# EasyEDA Pro project ProProject_ads1299+stm32f407第七版_2024-07-30.epro, schematic 无线脑电信号采集系统V1.0

## Sheets
1 原理图_页1_芯片与pcb基本功能: Create Date: 2024-03-14; Page Name: 原理图_页1_芯片与pcb基本功能; Project Name: ads1299+stm32f407第七版; Schematic Name: 无线脑电信号采集系统V1.0; Update Date: 2024-05-11; Company: 广西嵌入式技术与智能系统重点实验室; Drawed: 王中天; Page Size: A4; Version: V1.0
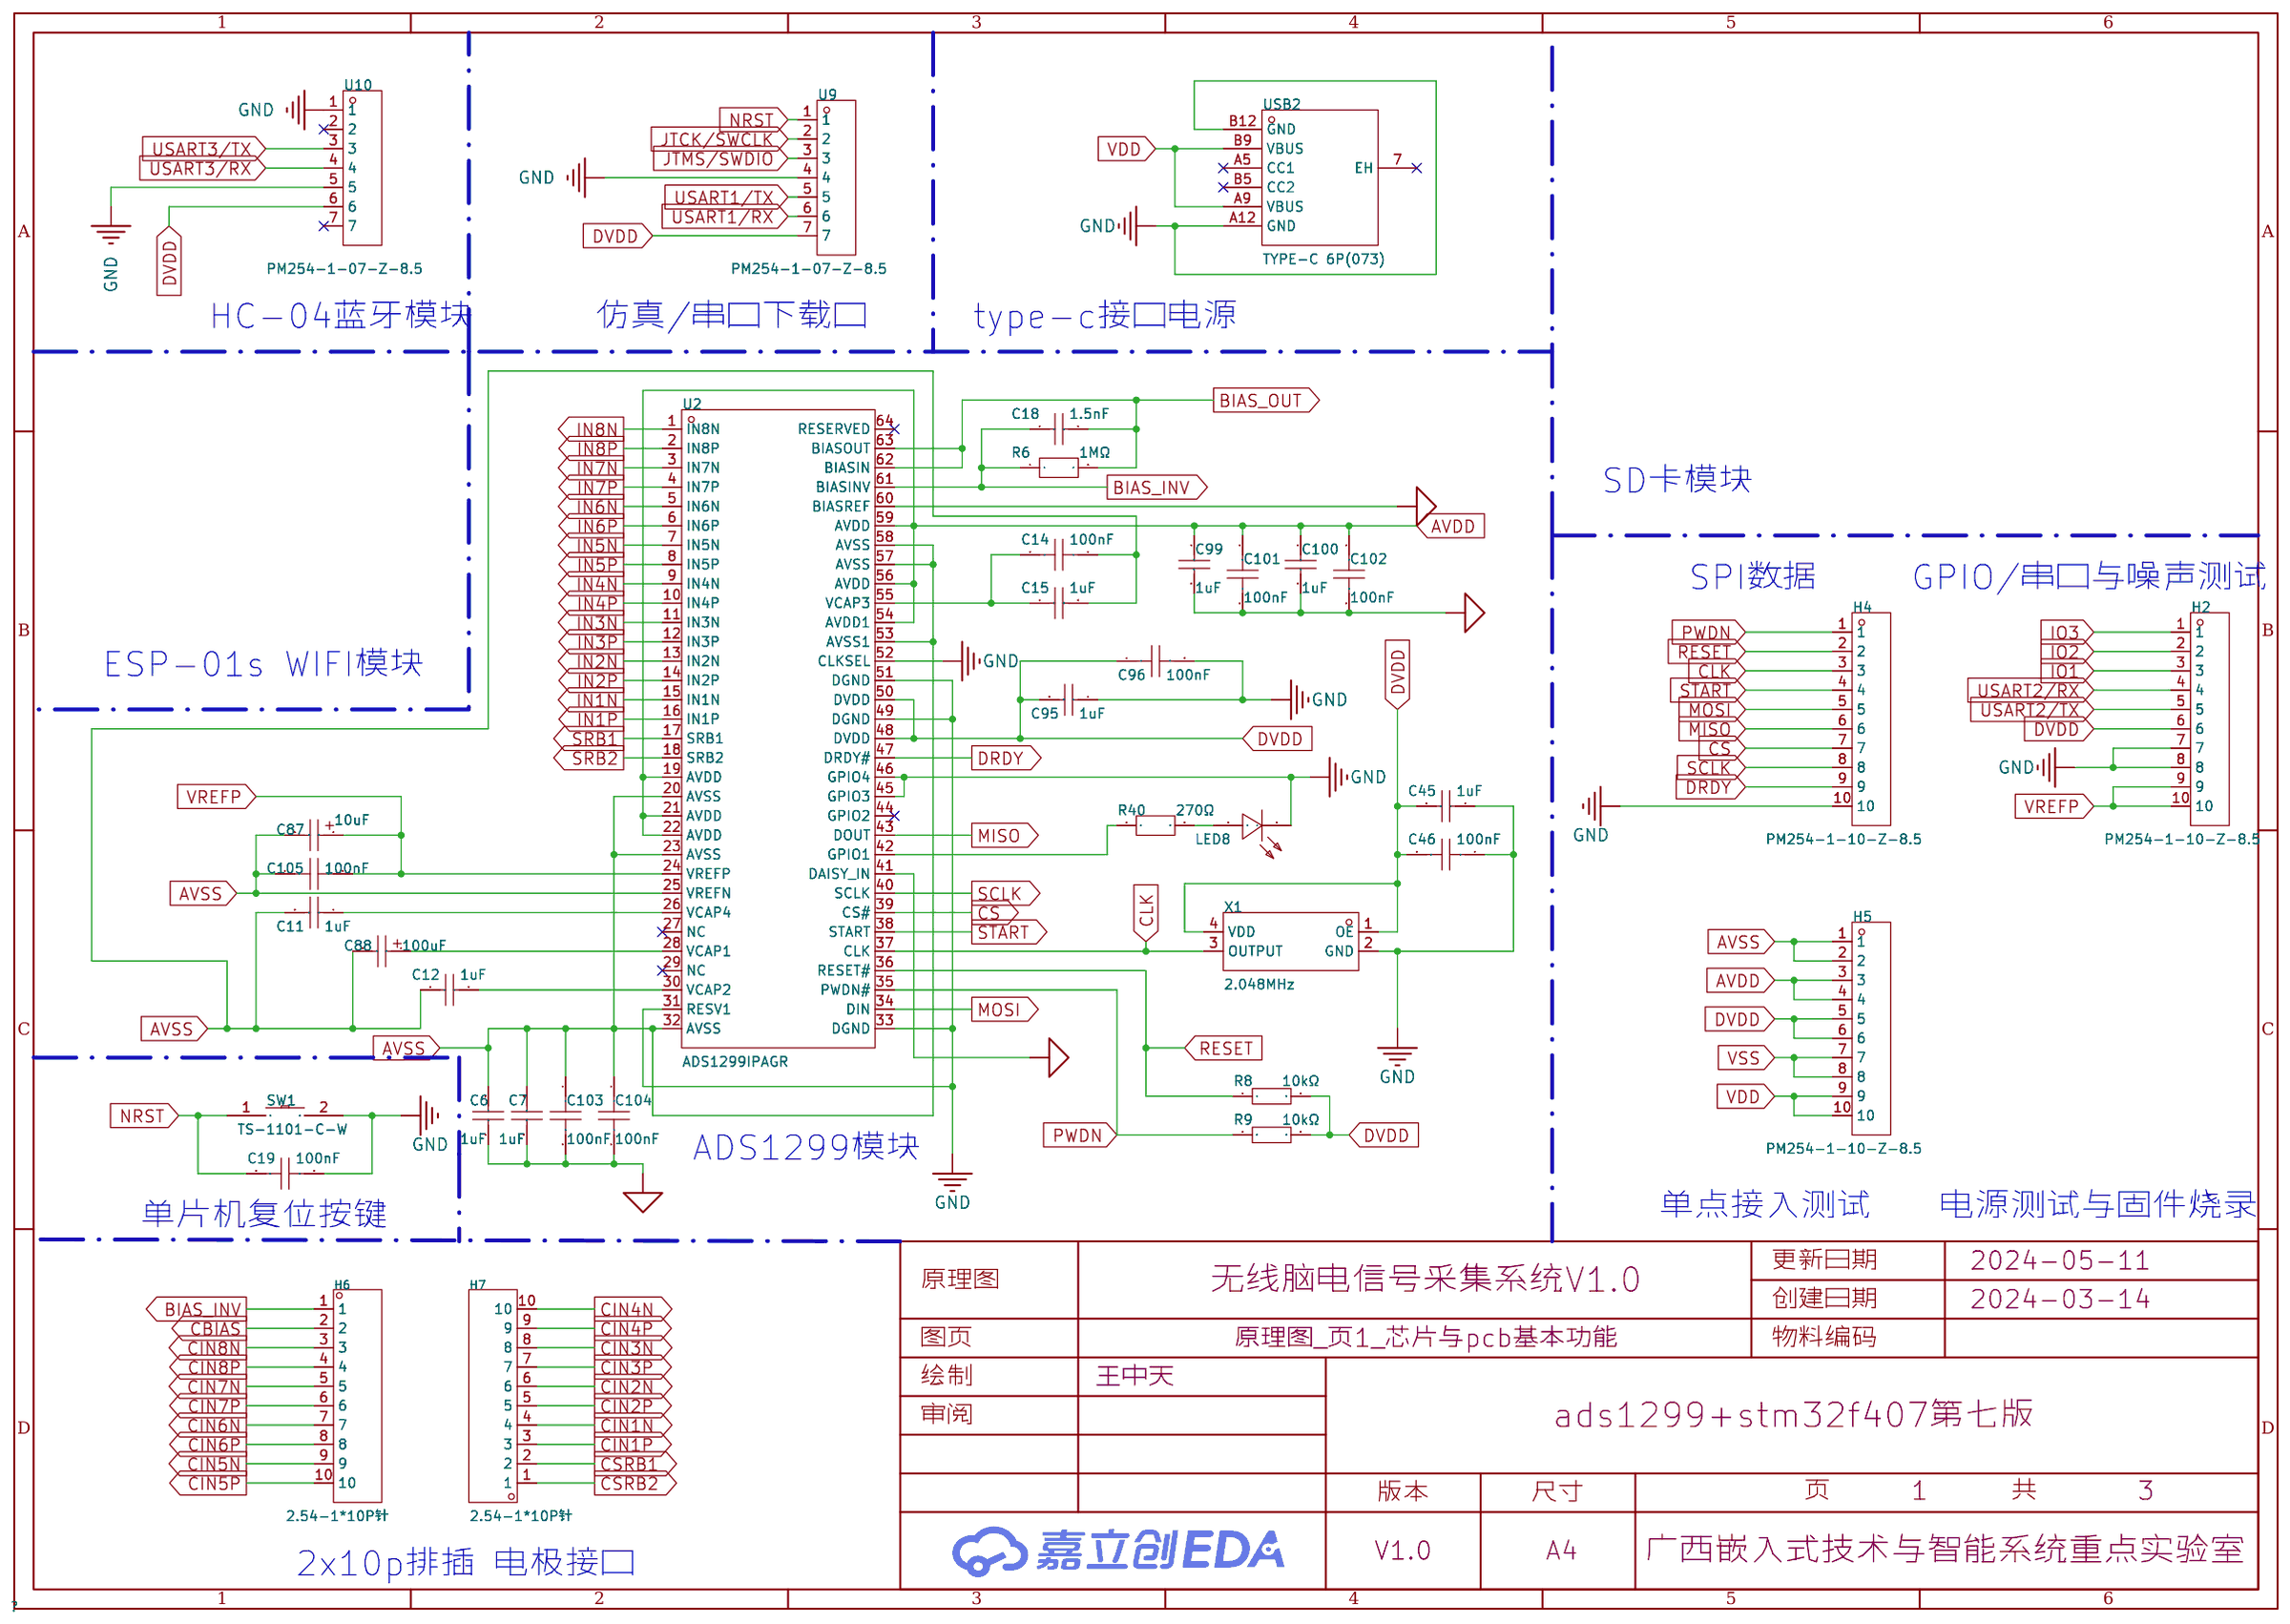
[diagram p0: 原理图_页1_芯片与pcb基本功能]
2 原理图_页2_单片机与电极接入: Create Date: 2024-03-15; Page Name: 原理图_页2_单片机与电极接入
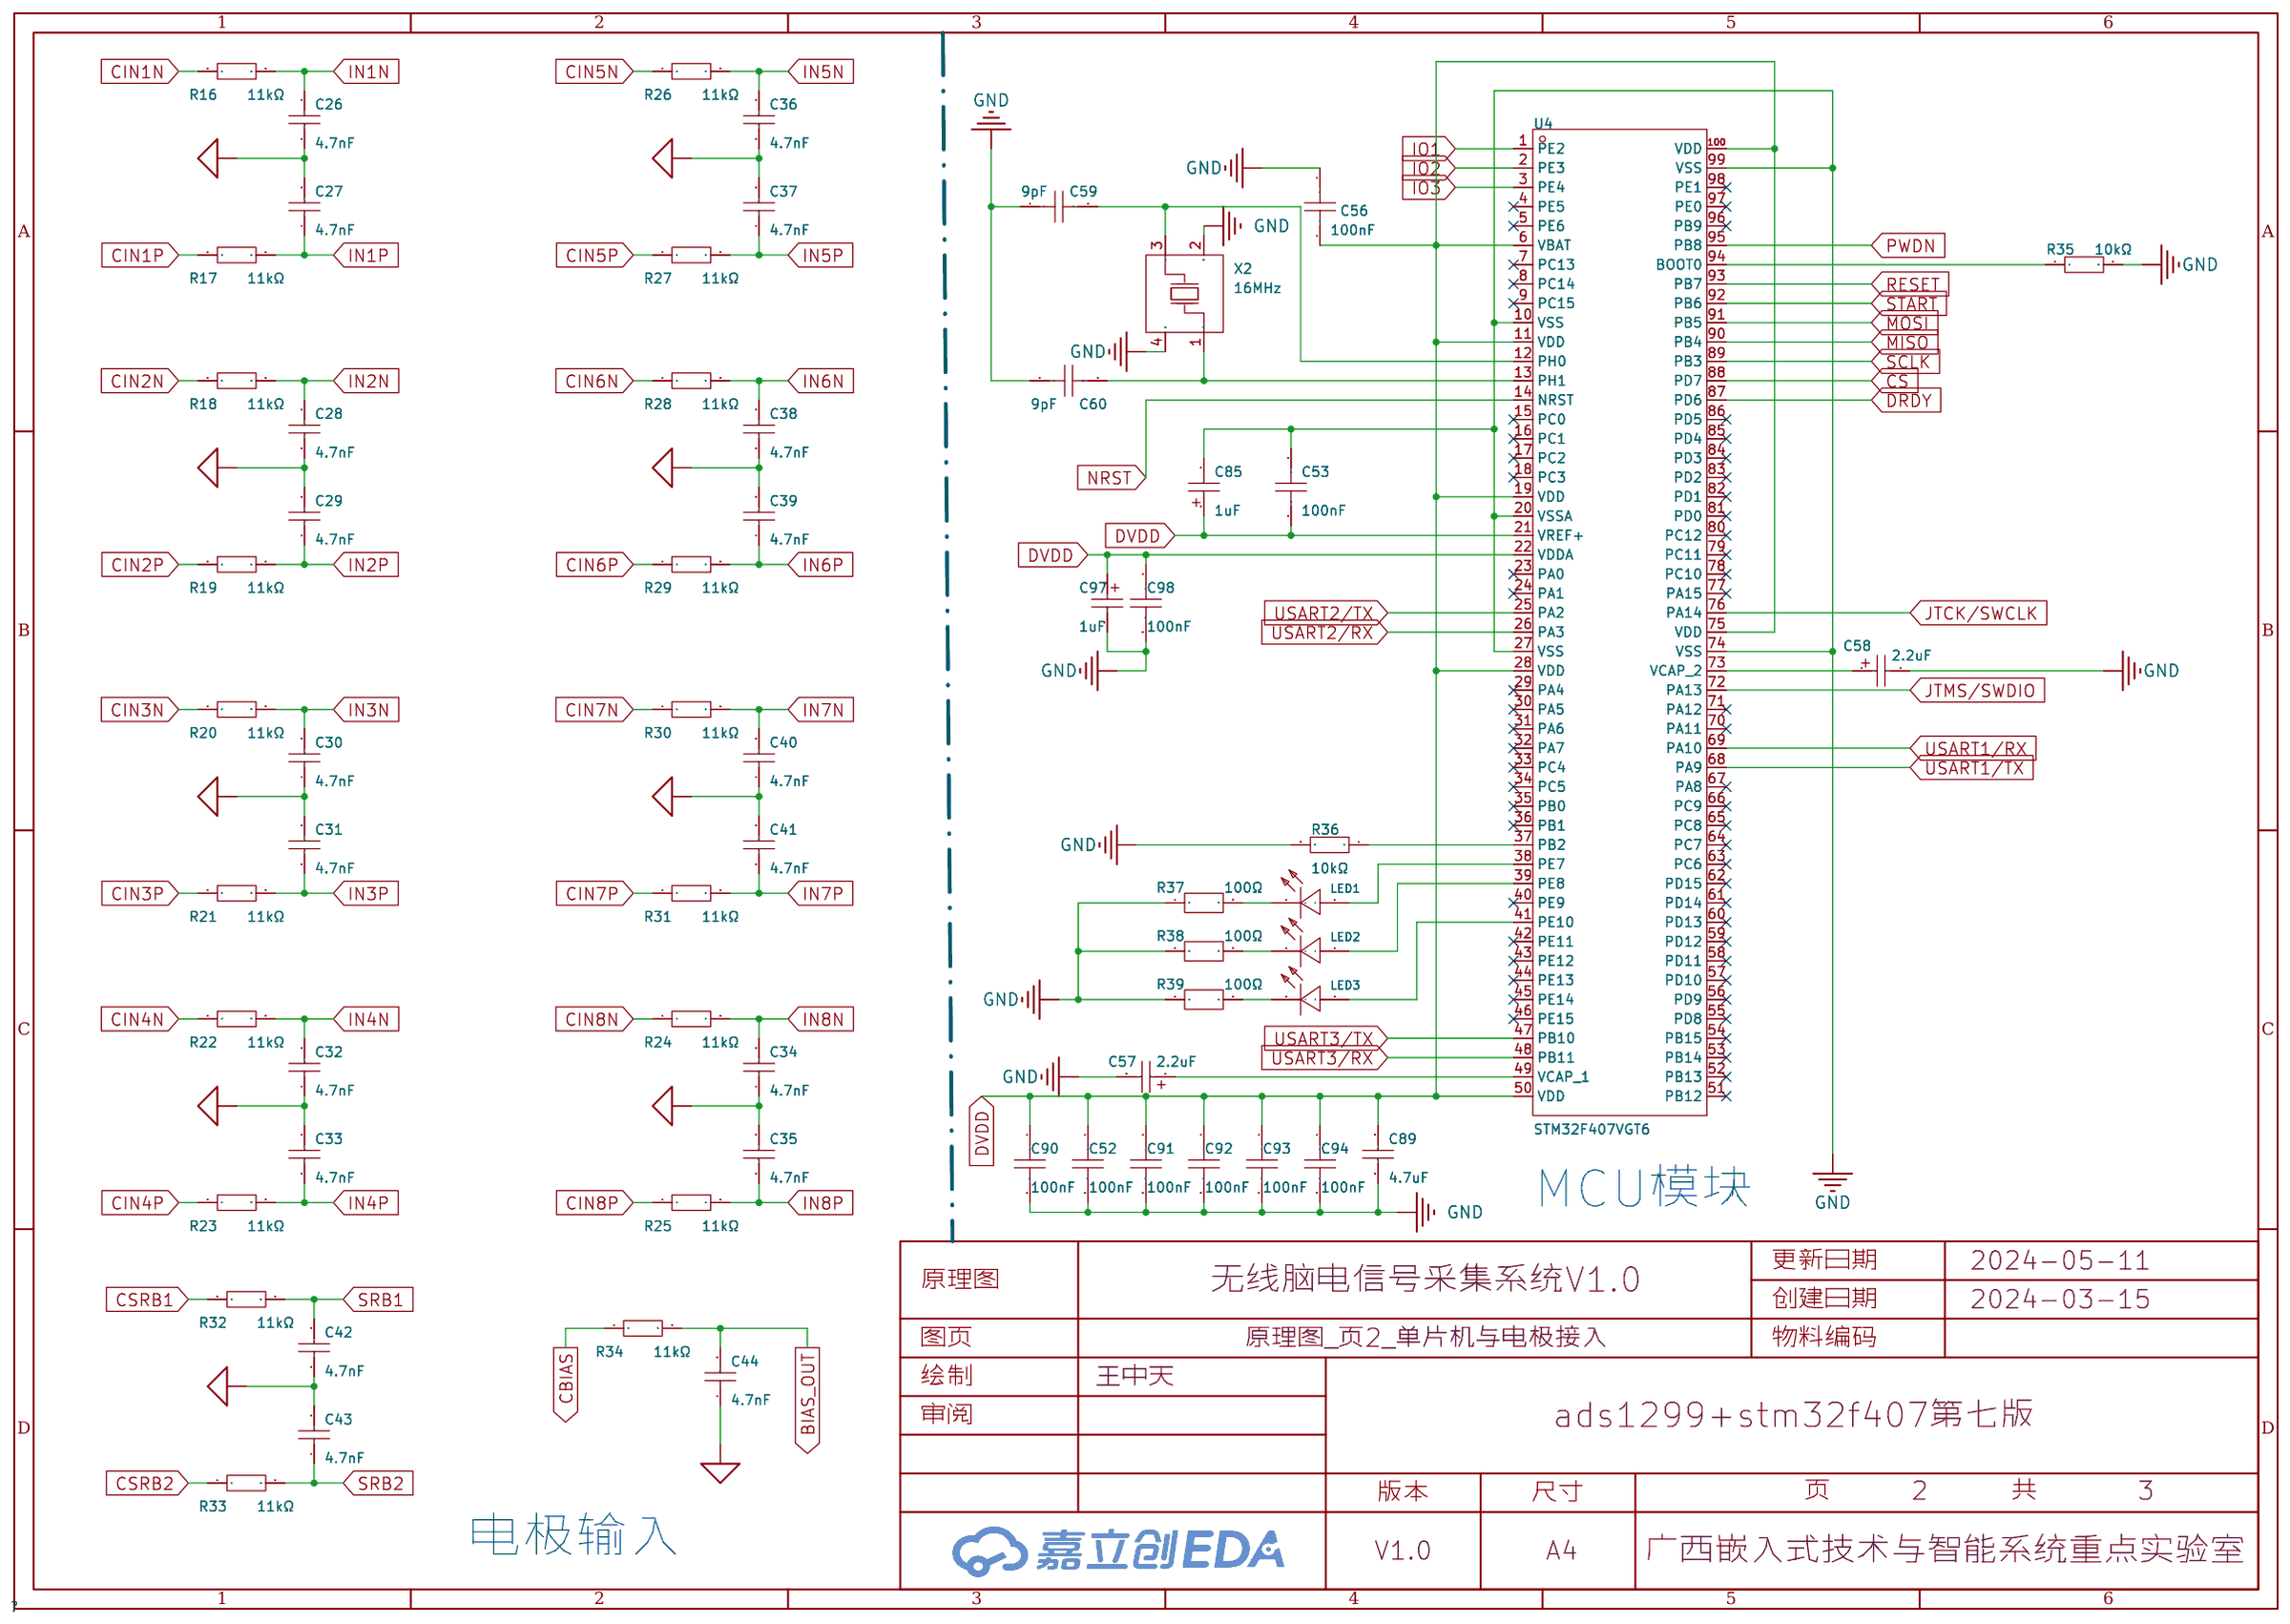
[diagram p1: 原理图_页2_单片机与电极接入]
3 原理图_页3_ldo与扩展功能: Create Date: 2024-03-24; Page Name: 原理图_页3_ldo与扩展功能; Update Date: 2024-05-12
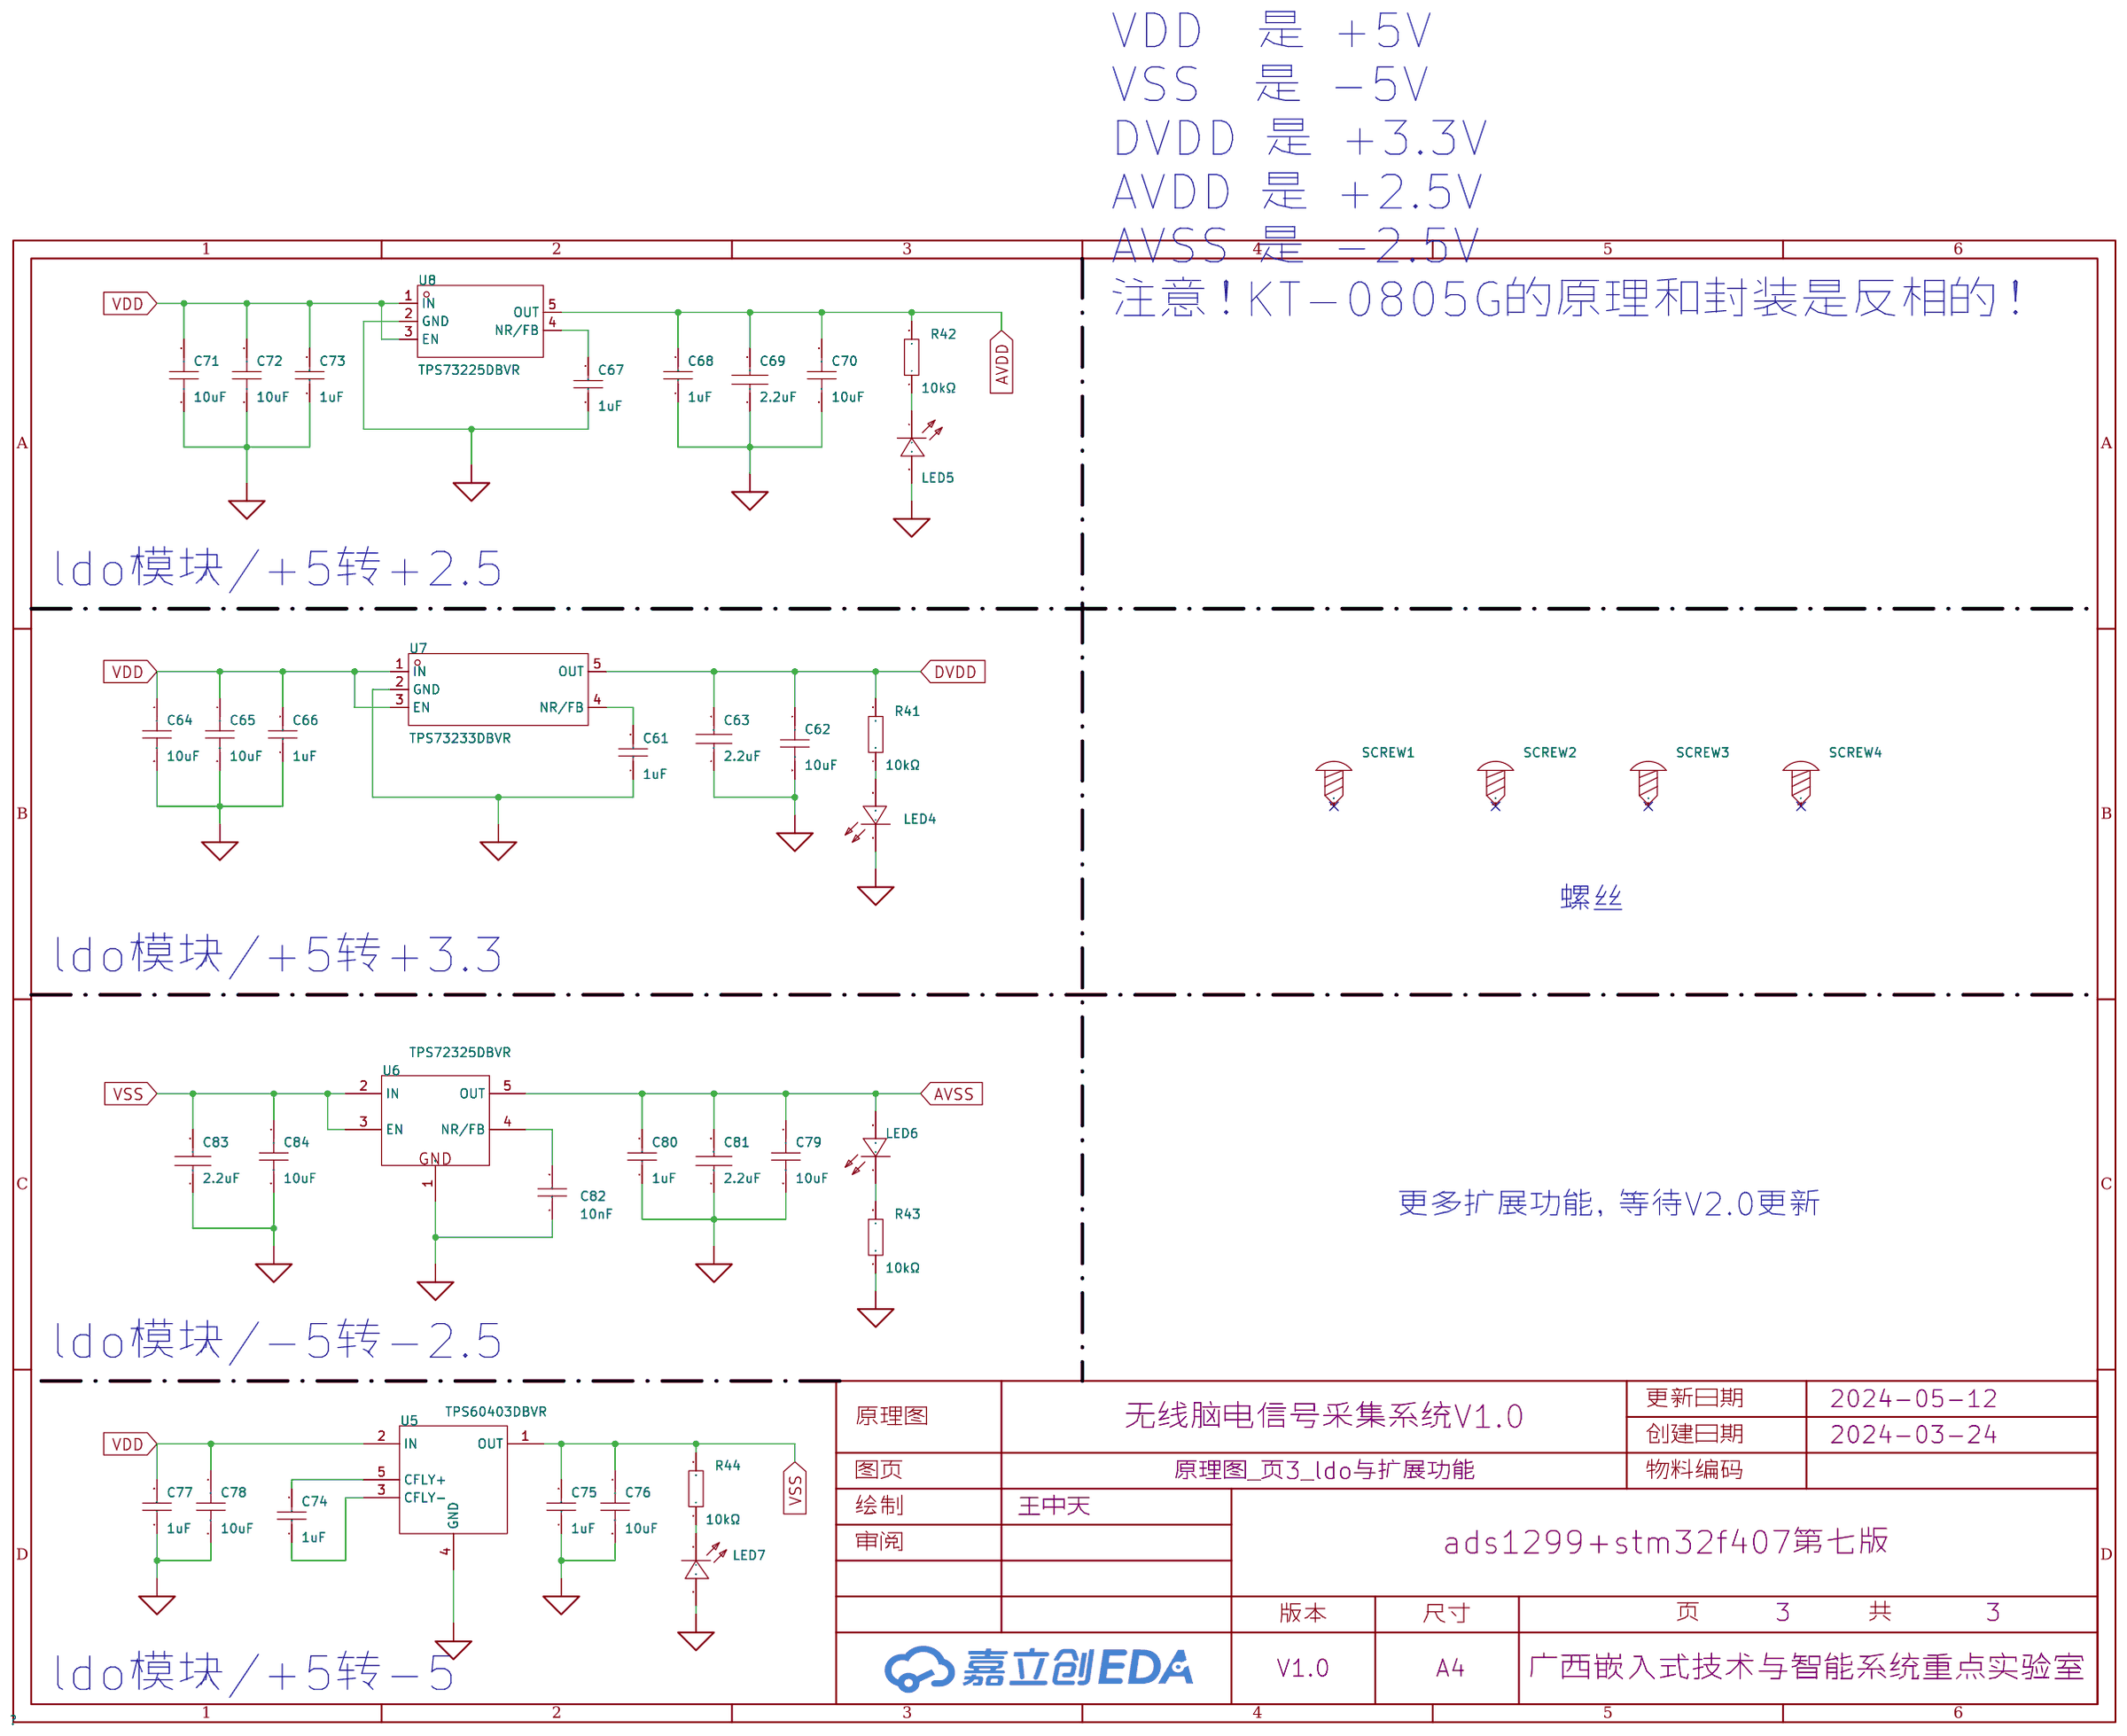
[diagram p2: 原理图_页3_ldo与扩展功能]

## Parts
sheet 原理图_页1_芯片与pcb基本功能
C6  1uF  [C0603]
C7  1uF  [C0603]
C11  1uF  [C0603]
C12  1uF  [C0603]
C14  100nF  [C0603]
C15  1uF  [C0603]
C18  1.5nF  [C0603]
C19  100nF  [C0603]
C45  1uF  [C0603]
C46  100nF  [C0603]
C87  10uF  [C0603]
C88  100uF  [CASE-B_3528]
C95  1uF  [C0603]
C96  100nF  [C0603]
C99  1uF  [C0603]
C100  1uF  [C0603]
C101  100nF  [C0603]
C102  100nF  [C0603]
C103  100nF  [C0603]
C104  100nF  [C0603]
C105  100nF  [C0603]
H2  PM254-1-10-Z-8.5  [HDR-TH_10P-P2.54-V-F]
H4  PM254-1-10-Z-8.5  [HDR-TH_10P-P2.54-V-F]
H5  PM254-1-10-Z-8.5  [HDR-TH_10P-P2.54-V-F]
H6  2.54-1*10P针  [HDR-TH_10P-P2.54-V-M-1]
H7  2.54-1*10P针  [HDR-TH_10P-P2.54-V-M-1]
LED8  KT-0603W  [LED0603-R-RD_WHITE]
R6  1MΩ  [R0805]
R8  10kΩ  [R0603]
R9  10kΩ  [R0603]
R40  270Ω  [R0603]
SW1  TS-1101-C-W  [SW-SMD_L6.0-W3.3-LS8.0]
U2  ADS1299IPAGR  [TQFP-64_L10.0-W10.0-P0.50-LS12.0-TL]
U9  PM254-1-07-Z-8.5  [HDR-TH_7P-P2.54-V-F]
U10  PM254-1-07-Z-8.5  [HDR-TH_7P-P2.54-V-F]
USB2  TYPE-C 6P(073)  [TYPE-C-SMD_TYPE-C-6P]
X1  2.048MHz  [OSC-SMD_4P-L7.0-W5.0-BL]
sheet 原理图_页2_单片机与电极接入
C26  4.7nF  [C0603]
C27  4.7nF  [C0603]
C28  4.7nF  [C0603]
C29  4.7nF  [C0603]
C30  4.7nF  [C0603]
C31  4.7nF  [C0603]
C32  4.7nF  [C0603]
C33  4.7nF  [C0603]
C34  4.7nF  [C0603]
C35  4.7nF  [C0603]
C36  4.7nF  [C0603]
C37  4.7nF  [C0603]
C38  4.7nF  [C0603]
C39  4.7nF  [C0603]
C40  4.7nF  [C0603]
C41  4.7nF  [C0603]
C42  4.7nF  [C0603]
C43  4.7nF  [C0603]
C44  4.7nF  [C0603]
C52  100nF  [C0603]
C53  100nF  [C0603]
C56  100nF  [C0603]
C57  2.2uF  [C0805]
C58  2.2uF  [C0805]
C59  9pF  [C0402]
C60  9pF  [C0402]
C85  1uF  [CASE-A_3216]
C89  4.7uF  [C0603]
C90  100nF  [C0603]
C91  100nF  [C0603]
C92  100nF  [C0603]
C93  100nF  [C0603]
C94  100nF  [C0603]
C97  1uF  [CASE-A_3216]
C98  100nF  [C0603]
LED1  KT-0603R  [LED0603-RD]
LED2  KT-0603R  [LED0603-RD]
LED3  KT-0603R  [LED0603-RD]
R16  11kΩ  [R0603]
R17  11kΩ  [R0603]
R18  11kΩ  [R0603]
R19  11kΩ  [R0603]
R20  11kΩ  [R0603]
R21  11kΩ  [R0603]
R22  11kΩ  [R0603]
R23  11kΩ  [R0603]
R24  11kΩ  [R0603]
R25  11kΩ  [R0603]
R26  11kΩ  [R0603]
R27  11kΩ  [R0603]
R28  11kΩ  [R0603]
R29  11kΩ  [R0603]
R30  11kΩ  [R0603]
R31  11kΩ  [R0603]
R32  11kΩ  [R0603]
R33  11kΩ  [R0603]
R34  11kΩ  [R0603]
R35  10kΩ  [R0603]
R36  10kΩ  [R0603]
R37  100Ω  [R0603]
R38  100Ω  [R0603]
R39  100Ω  [R0603]
U4  STM32F407VGT6  [LQFP-100_L14.0-W14.0-P0.50-LS16.0-BL]
X2  16MHz  [OSC-SMD_4P-L3.2-W2.5-BL]
sheet 原理图_页3_ldo与扩展功能
C61  1uF  [C0603]
C62  10uF  [C0603]
C63  2.2uF  [C0402]
C64  10uF  [C0603]
C65  10uF  [C0603]
C66  1uF  [C0603]
C67  1uF  [C0603]
C68  1uF  [C0603]
C69  2.2uF  [C0402]
C70  10uF  [C0603]
C71  10uF  [C0603]
C72  10uF  [C0603]
C73  1uF  [C0603]
C74  1uF  [C0603]
C75  1uF  [C0603]
C76  10uF  [C0603]
C77  1uF  [C0603]
C78  10uF  [C0603]
C79  10uF  [C0603]
C80  1uF  [C0603]
C81  2.2uF  [C0402]
C82  10nF  [C0603]
C83  2.2uF  [C0402]
C84  10uF  [C0603]
LED4  KT-0603W  [LED0603-R-RD_WHITE]
LED5  KT-0805G  [LED0805-R-RD]
LED6  KT-0805G  [LED0805-R-RD]
LED7  KT-0603W  [LED0603-R-RD_WHITE]
R41  10kΩ  [R0603]
R42  10kΩ  [R0603]
R43  10kΩ  [R0603]
R44  10kΩ  [R0603]
SCREW1  -  [M3螺丝]
SCREW2  -  [M3螺丝]
SCREW3  -  [M3螺丝]
SCREW4  -  [M3螺丝]
U5  TPS60403DBVR  [SOT-23-5_L3.0-W1.7-P0.95-LS2.8-BR]
U6  TPS72325DBVR  [SOT-23-5_L3.0-W1.7-P0.95-LS2.8-BR]
U7  TPS73233DBVR  [SOT-23-5_L3.0-W1.7-P0.95-LS2.8-BL]
U8  TPS73225DBVR  [SOT-23-5_L2.9-W1.6-P0.95-LS2.8-TL]

## Library data of the parts
C6 C7 C11 C12 C15 C45 C61 C66-C68 C73-C75 C77 C80 C95 C99 C100 = CL10A105KB8NNNC: 容值:1uF;精度:±10%;额定电压:50V;材质(温度系数):X5R;; LCSC Part Name: 1uF ±10% 50V; Supplier Part: C15849; Manufacturer: SAMSUNG(三星); Supplier Footprint: 0603; JLCPCB Part Class: 基础库; Datasheet: https://atta.szlcsc.com/upload/public/pdf/source/20160218/1457707763339.pdf; Supplier: LCSC; Tolerance: ±10%; Voltage Rated: 50V; Temperature Coefficient: X5R
C14 C19 C46 C52 C53 C56 C90-C94 C96 C98 C101-C105 = CC0603KRX7R9BB104: 容值:100nF;精度:±10%;额定电压:50V;材质(温度系数):X7R;; LCSC Part Name: 100nF ±10% 50V; Supplier Part: C14663; Manufacturer: YAGEO(国巨); Supplier Footprint: 0603; JLCPCB Part Class: Basic Part; Datasheet: https://atta.szlcsc.com/upload/public/pdf/source/20180910/C282072_33301C7F631E79921B82A8DAC6BCC5B3.pdf; Supplier: LCSC; Tolerance: ±10%; Voltage Rated: 50V; Temperature Coefficient: X7R
C18 = 0603B152K500NT: 容值:1.5nF;精度:±10%;额定电压:50V;材质(温度系数):X7R;; LCSC Part Name: 1.5nF ±10% 50V; Supplier Part: C1595; Manufacturer: FH(风华); Supplier Footprint: 0603; JLCPCB Part Class: 扩展库; Datasheet: https://atta.szlcsc.com/upload/public/pdf/source/20200305/C486355_26A10D38EF8C2A5C37091D0039909270.pdf; Supplier: LCSC; Tolerance: ±10%; Voltage Rated: 50V; Temperature Coefficient: X7R
C87 = CL10A106KP8NNNC: 容值:10uF;精度:±10%;额定电压:10V;材质(温度系数):X5R;; LCSC Part Name: 10uF ±10% 10V; Supplier Part: C19702; Manufacturer: SAMSUNG(三星); Supplier Footprint: 0603; JLCPCB Part Class: Basic Part; Datasheet: https://atta.szlcsc.com/upload/public/pdf/source/20160218/1457707763339.pdf; Supplier: LCSC; Tolerance: ±10%; Voltage Rated: 10V; Temperature Coefficient: X5R; Rated Voltage: 16V; Equivalent Series Resistance(ESR): 3Ω@100kHz; Operating Temperature: -55℃~+125℃
C88 = TAJB107K006RNJ: 容值:100uF;精度:±10%;额定电压:6.3V;等效串联电阻:1.7Ω@100kHz;; LCSC Part Name: 100uF ±10% 6.3V; Supplier Part: C16133; Manufacturer: Kyocera AVX; Supplier Footprint: CASE-B-3528; JLCPCB Part Class: 基础库; Datasheet: https://atta.szlcsc.com/upload/public/pdf/source/20160107/1457707750344.pdf; Supplier: LCSC; Tolerance: ±10%; Rated Voltage: 6.3V; Equivalent Series Resistance(ESR): 1.7Ω@100kHz; Operating Temperature: -55℃~+125℃
H2 H4 H5 = PM254-1-10-Z-8.5: 插孔结构:1x10P;间距:2.54mm;行距:-;圆孔/方孔:方孔;安装类型:直插;排数:单排;总孔位数:10P;额定电流:3A;额定电压:-;插孔方向:顶部;塑高:8.5mm;触头材质:铜合金;工作温度范围:-40℃~+105℃;焊接温度(最大值):260℃@5S;; LCSC Part Name: 1x10P 间距:2.54mm 直插; Supplier Part: C2897373; Manufacturer: HCTL(华灿天禄); Supplier Footprint: 插件,P=2.54mm; JLCPCB Part Class: 扩展库; Datasheet: https://atta.szlcsc.com/upload/public/pdf/source/20230609/534BE42964C679BDE98E061007C4ABD6.pdf; Supplier: LCSC; Holes Structure: 1x10P; Pitch: 2.54mm; Circular Hole / Square Hole: 方孔; Mounting Type: 直插; Number of Rows: 单排; Number of Holes: 10P; Current Rating (Max): 3A; Holes Direction: 顶部; Insulation Height: 8.5mm; Contact Material: 铜合金; Operating Temperature Range: -40℃~+105℃; Soldering Temperature(Max): 260℃@5S
H6 H7 = 2.54-1*10P针: 插针结构:1x10P;间距:2.54mm;行距:-;圆针/方针:方针;安装类型:直插;排数:单排;总PIN位数:10P;额定电流:3A;额定电压:-;配合针长度:-;塑高:-;端接针长度:-;触头材质:-;触头镀层:-;工作温度范围:-40℃~+105℃;颜色:黑色;; LCSC Part Name: 间距:2.54mm 1x10P 直插 方针; Supplier Part: C57369; Manufacturer: BOOMELE(博穆精密); Supplier Footprint: 插件,P=2.54mm; JLCPCB Part Class: 扩展库; Datasheet: https://atta.szlcsc.com/upload/public/pdf/source/20151109/1457707572883.pdf; Supplier: LCSC; Pin Structure: 1x10P; Pitch: 2.54mm; Circluar Pins/Square Pins: 方针; Mounting Type: 直插; Number of Rows: 单排; Number of Pins: 10P; Current Rating (Max): 3A; Operating Temperature Range: -40℃~+105℃; Color: 黑色
LED4 LED7 LED8 = KT-0603W: 发光颜色:白色;; LCSC Part Name: 0603 白灯 高亮; Supplier Part: C2290; Manufacturer: KENTO; Supplier Footprint: 0603; JLCPCB Part Class: Basic Part; Datasheet: https://atta.szlcsc.com/upload/public/pdf/source/20221101/4C23D5C85BA051E44A00B833D0A41468.pdf; Supplier: LCSC; Emitted Color: 白色; Forward Voltage (VF): 3.3V; Power Dissipation: 66mW; Forward Current: 10mA; Dominant Wavelength: 517nm~527nm; Lens Color: 无色透明透镜; Luminous Intensity: 800mcd; Viewing Angle: 130°; Mounting Sytle: 正贴; Operating Temperature: -40℃~+85℃
R6 = 0805W8F1004T5E: 电阻类型:厚膜电阻;阻值:1MΩ;精度:±1%;功率:125mW;最大工作电压:150V;温度系数:±100ppm/℃;; LCSC Part Name: 1MΩ ±1% 125mW 厚膜电阻; Supplier Part: C17514; Manufacturer: UNI-ROYAL(厚声); Supplier Footprint: 0805; JLCPCB Part Class: Basic Part; Datasheet: https://atta.szlcsc.com/upload/public/pdf/source/20200306/C422600_1E6D84923E4A46A82E41ADD87F860B5C.pdf; Supplier: LCSC; Type: 厚膜电阻; Tolerance: ±1%; Power(Watts): 125mW; Overload Voltage (Max): 150V; Temperature Coefficient: ±100ppm/℃; Operating Temperature Range: -55℃~+155℃
R8 R9 R35 R36 R41-R44 = 0603WAF1002T5E: 电阻类型:厚膜电阻;阻值:10kΩ;精度:±1%;功率:100mW;最大工作电压:75V;温度系数:±100ppm/℃;; LCSC Part Name: 厚膜电阻 10kΩ ±1% 100mW; Supplier Part: C25804; Manufacturer: UNI-ROYAL(厚声); Supplier Footprint: 0603; JLCPCB Part Class: Basic Part; Datasheet: https://atta.szlcsc.com/upload/public/pdf/source/20200306/C422600_1E6D84923E4A46A82E41ADD87F860B5C.pdf; Supplier: LCSC; Type: 厚膜电阻; Tolerance: ±1%; Power(Watts): 100mW; Overload Voltage (Max): 75V; Temperature Coefficient: ±100ppm/℃; Operating Temperature Range: -55℃~+155℃
R40 = 0603WAF2700T5E: 电阻类型:厚膜电阻;阻值:270Ω;精度:±1%;功率:100mW;最大工作电压:75V;温度系数:±100ppm/℃;; LCSC Part Name: 270Ω ±1% 100mW 厚膜电阻; Supplier Part: C22966; Manufacturer: UNI-ROYAL(厚声); Supplier Footprint: 0603; JLCPCB Part Class: Basic Part; Datasheet: https://atta.szlcsc.com/upload/public/pdf/source/20200306/C422600_1E6D84923E4A46A82E41ADD87F860B5C.pdf; Supplier: LCSC; Type: 厚膜电阻; Tolerance: ±1%; Power(Watts): 100mW; Overload Voltage (Max): 75V; Temperature Coefficient: ±100ppm/℃; Operating Temperature Range: -55℃~+155℃
SW1 = TS-1101-C-W: 电路结构:单刀单掷;按钮形状:矩形按钮;作用力:260gf;安装方式:立贴;开关长度:6mm;开关宽度:3.6mm;开关高度:2.5mm;带支架:不带;触点电流:50mA;额定电压(AC):-;额定电压(DC):12V;额定功率:-;绝缘电阻:-;带灯:无;机械寿命:5万次;; LCSC Part Name: 6*3.6*2.5mm 立贴 轻触开关; Supplier Part: C318938; Manufacturer: XKB Connectivity(中国星坤); Supplier Footprint: SMD; JLCPCB Part Class: 扩展库; Datasheet: https://atta.szlcsc.com/upload/public/pdf/source/20200227/C318938_C2E53B1EEDE37D980A33616AC086DE53.pdf; Supplier: LCSC; Circuit: 单刀单掷; Actuator Style: 矩形按钮; Operating Force: 260gf; Mounting Style: 立贴; Switch Length: 6mm; Switch Width: 3.6mm; Switch Height: 2.5mm; Strike Gundam: 不带; Contact Current: 50mA; Voltage Rating (DC): 12V; Actuator/Cap Color: 白色带淡绿; With Lamp: 无; Mechanical Life: 5万次; Operating Temperature: -30℃~+85℃
U2 = ADS1299IPAGR: 电源电压:5V；1.8V~3.6V;; Supplier Part: C476817; Manufacturer: TI(德州仪器); Supplier Footprint: TQFP-64(10x10); JLCPCB Part Class: 扩展库; Datasheet: https://www.ti.com/cn/lit/gpn/ads1299; Supplier: LCSC; Supply Voltage: 5V；1.8V~3.6V
U9 U10 = PM254-1-07-Z-8.5: 插孔结构:1x7P;间距:2.54mm;行距:-;圆孔/方孔:方孔;安装类型:直插;排数:单排;总孔位数:7P;额定电流:3A;额定电压:-;插孔方向:顶部;塑高:8.5mm;触头材质:铜合金;工作温度范围:-40℃~+105℃;焊接温度(最大值):260℃@5S;; LCSC Part Name: 1x7P 间距:2.54mm 直插; Supplier Part: C2897370; Manufacturer: HCTL(华灿天禄); Supplier Footprint: 插件,P=2.54mm; JLCPCB Part Class: 扩展库; Datasheet: https://atta.szlcsc.com/upload/public/pdf/source/20230609/534BE42964C679BDE98E061007C4ABD6.pdf; Supplier: LCSC; Holes Structure: 1x7P; Pitch: 2.54mm; Circular Hole / Square Hole: 方孔; Mounting Type: 直插; Number of Rows: 单排; Number of Holes: 7P; Current Rating (Max): 3A; Holes Direction: 顶部; Insulation Height: 8.5mm; Contact Material: 铜合金; Operating Temperature Range: -40℃~+105℃; Soldering Temperature(Max): 260℃@5S
USB2 = TYPE-C 6P(073): 连接器类型:Type-C;标准:-;公母:母;端口数量:1;触点数量:6P;安装方式:卧贴;额定电流 - 电源:5A;工作温度范围:-25℃~+85℃;; LCSC Part Name: Type-C 母 卧贴; Supplier Part: C668623; Manufacturer: SHOU HAN(首韩); Supplier Footprint: SMD; JLCPCB Part Class: 扩展库; Datasheet: https://atta.szlcsc.com/upload/public/pdf/source/20200618/C668623_A4B260DED7AC1949BAC6AE39E9F4CD80.pdf; Supplier: LCSC; Connector Type: Type-C; Gender: 母; Number of Ports: 1; Number of Contacts: 6P; Mounting Style: 卧贴; Current Rating - Power (Max): 5A; Operating Temperature Range: -25℃~+85℃
X1 = S7D2.048000B20F30T: 频率:2.048MHz;输出模式:CMOS;工作电压:3.3V;供电电流:10mA;频率稳定度(全温):±30ppm;; LCSC Part Name: 2.048MHz ±20ppm 3.3V CMOS; Supplier Part: C386898; Manufacturer: SCTF(星通时频); Supplier Footprint: SMD7050-4P; JLCPCB Part Class: 扩展库; Datasheet: https://atta.szlcsc.com/upload/public/pdf/source/20220907/5C59772A3484C0E3092C365267A71772.pdf; Supplier: LCSC; Output Type: CMOS; Supply Voltage: 3.3V; Supply Current (Max): 10mA; Frequency Stability(Full temperature range): ±30ppm; Operating Temperature: -40℃~+85℃
C26-C44 = 0603B472K500NT: 容值:4.7nF;精度:±10%;额定电压:50V;材质(温度系数):X7R;; LCSC Part Name: 4.7nF ±10% 50V; Supplier Part: C53987; Manufacturer: FH(风华); Supplier Footprint: 0603; JLCPCB Part Class: 基础库; Datasheet: https://atta.szlcsc.com/upload/public/pdf/source/20200305/C486355_26A10D38EF8C2A5C37091D0039909270.pdf; Supplier: LCSC; Tolerance: ±10%; Voltage Rated: 50V; Temperature Coefficient: X7R
C57 C58 = CL21A225KBQNNNE: 容值:2.2uF;精度:±10%;额定电压:50V;材质(温度系数):X5R;; LCSC Part Name: 2.2uF ±10% 50V; Supplier Part: C377773; Manufacturer: SAMSUNG(三星); Supplier Footprint: 0805; JLCPCB Part Class: Basic Part; Datasheet: https://atta.szlcsc.com/upload/public/pdf/source/20160218/1457707763339.pdf; Supplier: LCSC; Tolerance: ±10%; Voltage Rated: 50V; Temperature Coefficient: X5R; Rated Voltage: 16V; Equivalent Series Resistance(ESR): 6.5Ω@100kHz; Operating Temperature: -55℃~+125℃
C59 C60 = TCC0402COG9R0D500AT: 容值:9pF;额定电压:50V;材质(温度系数):C0G;; LCSC Part Name: 9pF 50V; Supplier Part: C696893; Manufacturer: CCTC(三环); Supplier Footprint: 0402; JLCPCB Part Class: 扩展库; Datasheet: https://atta.szlcsc.com/upload/public/pdf/source/20200707/C696841_89A2C111301AB76AE7642008585E7A11.pdf; Supplier: LCSC; Voltage Rated: 50V; Temperature Coefficient: C0G
C85 C97 = TAJA105K016RNJ: 容值:1uF;精度:±10%;额定电压:16V;等效串联电阻:11Ω;; LCSC Part Name: 1uF ±10% 16V; Supplier Part: C7174; Manufacturer: Kyocera AVX; Supplier Footprint: CASE-A-3216; JLCPCB Part Class: 扩展库; Datasheet: https://atta.szlcsc.com/upload/public/pdf/source/20160107/1457707750344.pdf; Supplier: LCSC; Tolerance: ±10%; Rated Voltage: 16V; Equivalent Series Resistance(ESR): 11Ω; Operating Temperature: -55℃~+125℃
C89 = CL10A475KO8NNNC: 容值:4.7uF;精度:±10%;额定电压:16V;材质(温度系数):X5R;; LCSC Part Name: 4.7uF ±10% 16V; Supplier Part: C19666; Manufacturer: SAMSUNG(三星); Supplier Footprint: 0603; JLCPCB Part Class: 基础库; Datasheet: https://atta.szlcsc.com/upload/public/pdf/source/20160218/1457707763339.pdf; Supplier: LCSC; Tolerance: ±10%; Voltage Rated: 16V; Temperature Coefficient: X5R
LED1-LED3 = KT-0603R: 发光颜色:红色;功率:-;正向电流:-;主波长:-;二极管配置:-;透镜颜色:-;色温:-;发光角度:-;载带方式:-;工作温度:-40℃~+85℃;; LCSC Part Name: 0603 红灯 高亮; Supplier Part: C2286; Manufacturer: KENTO; Supplier Footprint: 0603; JLCPCB Part Class: Basic Part; Datasheet: https://atta.szlcsc.com/upload/public/pdf/source/20160616/1466072038404.pdf; Supplier: LCSC; Emitted Color: 红色; Operating Temperature: -40℃~+85℃; Forward Voltage (VF): 2V; Luminous Intensity: 16.25mcd
R16-R34 = 0603WAF1102T5E: 电阻类型:厚膜电阻;阻值:11kΩ;精度:±1%;功率:100mW;最大工作电压:75V;温度系数:±100ppm/℃;; LCSC Part Name: 11kΩ ±1% 100mW 厚膜电阻; Supplier Part: C25950; Manufacturer: UNI-ROYAL(厚声); Supplier Footprint: 0603; JLCPCB Part Class: Extended Part; Datasheet: https://atta.szlcsc.com/upload/public/pdf/source/20200306/C422600_1E6D84923E4A46A82E41ADD87F860B5C.pdf; Supplier: LCSC; Type: 厚膜电阻; Tolerance: ±1%; Power(Watts): 100mW; Overload Voltage (Max): 75V; Temperature Coefficient: ±100ppm/℃; Operating Temperature Range: -55℃~+155℃
R37-R39 = 0603WAF1000T5E: 电阻类型:厚膜电阻;阻值:100Ω;精度:±1%;功率:100mW;最大工作电压:75V;温度系数:±200ppm/℃;; LCSC Part Name: 100Ω ±1% 100mW 厚膜电阻; Supplier Part: C22775; Manufacturer: UNI-ROYAL(厚声); Supplier Footprint: 0603; JLCPCB Part Class: Basic Part; Datasheet: https://atta.szlcsc.com/upload/public/pdf/source/20200306/C422600_1E6D84923E4A46A82E41ADD87F860B5C.pdf; Supplier: LCSC; Type: 厚膜电阻; Tolerance: ±1%; Power(Watts): 100mW; Overload Voltage (Max): 75V; Temperature Coefficient: ±200ppm/℃; Operating Temperature Range: -55℃~+155℃
U4 = STM32F407VGT6: CPU内核:CM4;程序存储容量:1MB;RAM总容量:192KB;GPIO端口数量:82;工作电压范围:1.8V~3.6V;CPU最大主频:168MHz;程序存储器类型:FLASH;; Supplier Part: C12345; Manufacturer: ST(意法半导体); Supplier Footprint: LQFP-100(14x14); JLCPCB Part Class: 扩展库; Datasheet: https://atta.szlcsc.com/upload/public/pdf/source/20201130/C919362_39400D478C258148B3DF984CE4A4041A.pdf; Supplier: LCSC; CPU Core: CM4; Program Storage Size: 1MB; RAM Size: 192KB; GPIO Ports Number: 82; Operating Voltage Range: 1.8V~3.6V; CPU Maximum Speed: 168MHz; Program Memory Type: FLASH; Operating Temperature Range: -40℃~+85℃; ADC (Bit): 12bit; DAC (Bit): 12bit; Universal Serial Bus: 有; Peripheral/Function: DMA；LCD/LED驱动; Watchdog: 有; Infrared Data Association: 有; Low-Voltage Detect: 有; LCD Module: 有; Direct Memory Access: 有; Internal Oscillator: 有
X2 = X322516MLB4SI: 晶振类型:贴片晶振;频率:16MHz;常温频差:±10ppm;外接负载电容:9pF;频率稳定度(全温):±20ppm;; LCSC Part Name: 16MHz ±10ppm 9pF; Supplier Part: C13738; Manufacturer: YXC(扬兴晶振); Supplier Footprint: SMD3225-4P; JLCPCB Part Class: 基础库; Datasheet: https://atta.szlcsc.com/upload/public/pdf/source/20240329/19D5F850207469550BEB00D7DFEDBC7A.pdf; Supplier: LCSC; Crystal Type: 贴片晶振; Normal temperature Frequency Tolerance: ±10ppm; External load capacitor: 9pF; Frequency Stability(Full temperature range): ±20ppm; Operating Temperature: -40℃~+85℃
C62 C64 C65 C70-C72 C76 C78 C79 C84 = CL10A106KP8NNNC: 容值:10uF;精度:±10%;额定电压:10V;材质(温度系数):X5R;; LCSC Part Name: 10uF ±10% 10V; Supplier Part: C19702; Manufacturer: SAMSUNG(三星); Supplier Footprint: 0603; JLCPCB Part Class: Basic Part; Datasheet: https://atta.szlcsc.com/upload/public/pdf/source/20160218/1457707763339.pdf; Supplier: LCSC; Tolerance: ±10%; Voltage Rated: 10V; Temperature Coefficient: X5R
C63 C69 C81 C83 = CL05A225MQ5NSNC: 容值:2.2uF;精度:±20%;额定电压:6.3V;材质(温度系数):X5R;; LCSC Part Name: 2.2uF ±20% 6.3V; Supplier Part: C12530; Manufacturer: SAMSUNG(三星); Supplier Footprint: 0402; JLCPCB Part Class: 基础库; Datasheet: https://atta.szlcsc.com/upload/public/pdf/source/20160218/1457707763339.pdf; Supplier: LCSC; Tolerance: ±20%; Voltage Rated: 6.3V; Temperature Coefficient: X5R
C82 = 0603B103K500NT: 容值:10nF;精度:±10%;额定电压:50V;材质(温度系数):X7R;; LCSC Part Name: 10nF ±10% 50V; Supplier Part: C57112; Manufacturer: FH(风华); Supplier Footprint: 0603; JLCPCB Part Class: Basic Part; Datasheet: https://atta.szlcsc.com/upload/public/pdf/source/20200305/C486355_26A10D38EF8C2A5C37091D0039909270.pdf; Supplier: LCSC; Tolerance: ±10%; Voltage Rated: 50V; Temperature Coefficient: X7R
LED5 LED6 = KT-0805G: 灯头类型:-;发光颜色:翠绿色;正向电压(VF):-;功率:-;正向电流:-;主波长:-;二极管配置:-;透镜颜色:-;色温:-;发光强度:-;发光角度:-;载带方式:-;工作温度:-;; LCSC Part Name: 0805 翠绿 高亮; Supplier Part: C2297; Manufacturer: KENTO; Supplier Footprint: 0805; JLCPCB Part Class: Basic Part; Datasheet: https://atta.szlcsc.com/upload/public/pdf/source/20170209/1486607340485.pdf; Supplier: LCSC; Emitted Color: 翠绿色
SCREW1-SCREW4 = M3螺丝: Supplier Footprint: 插件
U5 = TPS60403DBVR: 功能类型:-;输出类型:固定;输入电压:1.8V~5.25V;输出电压:-5.5V~-1.6V;输出电流(最大值):60mA;; Supplier Part: C11338; Manufacturer: TI(德州仪器); Supplier Footprint: SOT-23-5; JLCPCB Part Class: 扩展库; Datasheet: https://www.ti.com/cn/lit/gpn/tps60403; Supplier: LCSC; Output Type: 固定; Input Voltage: 1.8V~5.25V; Output Voltage: -5.5V~-1.6V; Output Current (Max): 60mA; Switching Frequency: 250kHz; Operating Temperature: -40℃~+125℃@(TJ); Synchronous Rectification: 否; Number of Outputs: 1; Switch tube (built-in/external): 内置
U6 = TPS72325DBVR: 输出类型:固定;最大输入电压:10V;输出电压:2.5V;最大输出电流:200mA;电源纹波抑制比(PSRR):65dB;输出极性:负极;; LCSC Part Name: 输入10V 输出2.5V 200mA; Supplier Part: C69932; Manufacturer: TI(德州仪器); Supplier Footprint: SOT-23-5; JLCPCB Part Class: 扩展库; Datasheet: https://www.ti.com/cn/lit/gpn/tps723; Supplier: LCSC; Output Type: 固定; Maximum Input Voltage: 10V; Output Voltage: 2.5V; MAX Output Current: 200mA; Power Supply Rejection Ratio (PSRR): 65dB; Dropout Voltage: 500mV@(200mA); standby current: 200uA; Operating Temperature: -40℃~+125℃; Output Polarity: 负极; Number of Outputs: 1
U7 = TPS73233DBVR: 输出类型:固定;最大输入电压:5.5V;输出电压:3.3V;最大输出电流:250mA;电源纹波抑制比(PSRR):58dB;输出极性:正极;; LCSC Part Name: 输入5.5V 输出3.3V 250mA; Supplier Part: C181459; Manufacturer: TI(德州仪器); Supplier Footprint: SOT-23-5; JLCPCB Part Class: 扩展库; Datasheet: https://www.ti.com/cn/lit/gpn/tps732; Supplier: LCSC; Output Type: 固定; Maximum Input Voltage: 5.5V; Output Voltage: 3.3V; MAX Output Current: 250mA; Power Supply Rejection Ratio (PSRR): 58dB; Dropout Voltage: 150mV@(250mA); standby current: 550uA; Operating Temperature: -40℃~+125℃; Output Polarity: 正极; Number of Outputs: 1
U8 = TPS73225DBVR: 输出类型:固定;最大输入电压:5.5V;输出电压:2.5V;最大输出电流:250mA;输出极性:正极;; Supplier Part: C2758473; Manufacturer: TI(德州仪器); Supplier Footprint: SOT-23-5; JLCPCB Part Class: 扩展库; Datasheet: https://www.ti.com/cn/lit/gpn/tps732; Supplier: LCSC; Output Type: 固定; Maximum Input Voltage: 5.5V; Output Voltage: 2.5V; MAX Output Current: 250mA; Dropout Voltage: 150mV@(250mA); standby current: 550uA; Operating Temperature: -40℃~+125℃; Output Polarity: 正极; Number of Outputs: 1

## Nets
AVDD: C68.2 C69.2 C70.1 C99.1 C100.1 C101.1 C102.1 H5.3 H5.4 R42.2 U2.19(AVDD) U2.21(AVDD) U2.22(AVDD) U2.54(AVDD1) U2.56(AVDD) U2.59(AVDD) U8.5(OUT)
AVSS: C6.1 C7.1 C11.2 C12.1 C14.1 C15.2 C79.1 C80.2 C81.2 C87.2 C88.2 C103.1 C104.1 C105.1 H5.1 H5.2 LED6.2(A) U2.20(AVSS) U2.23(AVSS) U2.25(VREFN) U2.32(AVSS) U2.53(AVSS1) U2.57(AVSS) U2.58(AVSS) U6.5(OUT)
DVDD: C45.2 C46.2 C52.1 C53.2 C56.2 C62.1 C63.2 C85.1 C89.2 C90.1 C91.1 C92.1 C93.1 C94.1 C95.2 C96.1 C97.1 C98.1 H2.6 H5.5 H5.6 R8.2 R9.2 R41.2 U2.48(DVDD) U2.50(DVDD) U4.6(VBAT) U4.11(VDD) U4.19(VDD) U4.21(VREF+) U4.22(VDDA) U4.28(VDD) U4.50(VDD) U4.75(VDD) U4.100(VDD) U7.5(OUT) U9.7 U10.6 X1.1(OE) X1.4(VDD)
GND: C6.2 C7.2 C19.1 C26.1 C27.2 C28.1 C29.2 C30.1 C31.2 C32.1 C33.2 C34.1 C35.2 C36.1 C37.2 C38.1 C39.2 C40.1 C41.2 C42.1 C43.2 C44.1 C45.1 C46.1 C52.2 C53.1 C56.1 C57.2 C58.2 C59.1 C60.1 C61.1 C62.2 C63.1 C64.2 C65.2 C66.1 C67.1 C68.1 C69.1 C70.2 C71.2 C72.2 C73.1 C75.1 C76.2 C77.1 C78.2 C79.2 C80.1 C81.1 C82.1 C83.1 C84.2 C85.2 C89.1 C90.2 C91.2 C92.2 C93.2 C94.2 C95.1 C96.2 C97.2 C98.2 C99.2 C100.2 C101.2 C102.2 C103.2 C104.2 H2.7 H2.8 H4.10 LED4.2(K) LED5.2(A) LED7.1(A) LED8.2(K) R35.2 R36.2 R37.1 R38.1 R39.1 R43.1 SW1.2 U2.31(RESV1) U2.33(DGND) U2.41(DAISY_IN) U2.45(GPIO3) U2.46(GPIO4) U2.49(DGND) U2.51(DGND) U2.52(CLKSEL) U2.60(BIASREF) U4.10(VSS) U4.20(VSSA) U4.27(VSS) U4.74(VSS) U4.99(VSS) U5.4(GND) U6.1(GND) U7.2(GND) U8.2(GND) U9.4 U10.1 U10.5 USB2.A12(GND) USB2.B12(GND) X1.2(GND) X2.2(GND) X2.4(GND)
VDD: C64.1 C65.1 C66.2 C71.1 C72.1 C73.2 C77.2 C78.1 H5.9 H5.10 U5.2(IN) U7.1(IN) U7.3(EN) U8.1(IN) U8.3(EN) USB2.A9(VBUS) USB2.B9(VBUS)
VSS: C75.2 C76.1 C83.2 C84.1 H5.7 H5.8 R44.2 U5.1(OUT) U6.2(IN) U6.3(EN)
BIAS_INV: C18.1 H6.1 R6.1 U2.61(BIASINV)
BIAS_OUT: C18.2 C44.2 R6.2 R34.2 U2.62(BIASIN) U2.63(BIASOUT)
CBIAS: H6.2 R34.1
CIN1N: H7.4 R16.1
CIN1P: H7.3 R17.1
CIN2N: H7.6 R18.1
CIN2P: H7.5 R19.1
CIN3N: H7.8 R20.1
CIN3P: H7.7 R21.1
CIN4N: H7.10 R22.1
CIN4P: H7.9 R23.1
CIN5N: H6.9 R26.1
CIN5P: H6.10 R27.1
CIN6N: H6.7 R28.1
CIN6P: H6.8 R29.1
CIN7N: H6.5 R30.1
CIN7P: H6.6 R31.1
CIN8N: H6.3 R24.1
CIN8P: H6.4 R25.1
CLK: H4.3 U2.37(CLK) X1.3(OUTPUT)
CS: H4.7 U2.39(CS#) U4.88(PD7)
CSRB1: H7.2 R32.1
CSRB2: H7.1 R33.1
DRDY: H4.9 U2.47(DRDY#) U4.87(PD6)
IN1N: C26.2 R16.2 U2.15(IN1N)
IN1P: C27.1 R17.2 U2.16(IN1P)
IN2N: C28.2 R18.2 U2.13(IN2N)
IN2P: C29.1 R19.2 U2.14(IN2P)
IN3N: C30.2 R20.2 U2.11(IN3N)
IN3P: C31.1 R21.2 U2.12(IN3P)
IN4N: C32.2 R22.2 U2.9(IN4N)
IN4P: C33.1 R23.2 U2.10(IN4P)
IN5N: C36.2 R26.2 U2.7(IN5N)
IN5P: C37.1 R27.2 U2.8(IN5P)
IN6N: C38.2 R28.2 U2.5(IN6N)
IN6P: C39.1 R29.2 U2.6(IN6P)
IN7N: C40.2 R30.2 U2.3(IN7N)
IN7P: C41.1 R31.2 U2.4(IN7P)
IN8N: C34.2 R24.2 U2.1(IN8N)
IN8P: C35.1 R25.2 U2.2(IN8P)
IO1: H2.3 U4.1(PE2)
IO2: H2.2 U4.2(PE3)
IO3: H2.1 U4.3(PE4)
JTCK/SWCLK: U4.76(PA14) U9.2
JTMS/SWDIO: U4.72(PA13) U9.3
MISO: H4.6 U2.43(DOUT) U4.90(PB4)
MOSI: H4.5 U2.34(DIN) U4.91(PB5)
NRST: C19.2 SW1.1 U4.14(NRST) U9.1
PWDN: H4.1 R9.1 U2.35(PWDN#) U4.95(PB8)
RESET: H4.2 R8.1 U2.36(RESET#) U4.93(PB7)
SCLK: H4.8 U2.40(SCLK) U4.89(PB3)
SRB1: C42.2 R32.2 U2.17(SRB1)
SRB2: C43.1 R33.2 U2.18(SRB2)
START: H4.4 U2.38(START) U4.92(PB6)
USART1/RX: U4.69(PA10) U9.6
USART1/TX: U4.68(PA9) U9.5
USART2/RX: H2.4 U4.26(PA3)
USART2/TX: H2.5 U4.25(PA2)
USART3/RX: U4.48(PB11) U10.4
USART3/TX: U4.47(PB10) U10.3
VREFP: C87.1 C105.2 H2.9 H2.10 U2.24(VREFP)
$1N4831: C11.1 U2.26(VCAP4)
$1N5092: C14.2 C15.1 U2.55(VCAP3)
$1N7337: C12.2 U2.30(VCAP2)
$1N7431: C88.1 U2.28(VCAP1)
$1N25134: R40.1 U2.42(GPIO1)
$1N55226: LED8.1(A) R40.2
$2N5729: C58.1 U4.73(VCAP_2)
$2N5800: R35.1 U4.94(BOOT0)
$2N5854: R36.1 U4.37(PB2)
$2N6886: LED1.2(+) U4.38(PE7)
$2N6891: LED2.2(+) U4.39(PE8)
$2N6901: LED3.2(+) U4.41(PE10)
$2N6908: LED1.1(-) R37.2
$2N6911: LED2.1(-) R38.2
$2N6918: LED3.1(-) R39.2
$2N26546: C60.2 U4.13(PH1) X2.1(OSC1)
$2N26553: C59.2 U4.12(PH0) X2.3(OSC2)
$2N31920: C57.1 U4.49(VCAP_1)
$3N912: C61.2 U7.4(NR/FB)
$3N1315: C67.2 U8.4(NR/FB)
$3N1681: C74.2 U5.5(CFLY+)
$3N1685: C74.1 U5.3(CFLY-)
$3N2115: C82.2 U6.4(NR/FB)
$3N3985: LED4.1(A) R41.1
$3N4296: LED7.2(K) R44.1
$3N4331: LED6.1(K) R43.2
$3N4363: LED5.1(K) R42.1

Not connected (* = marked no-connect by the designer): SCREW1 1*; SCREW2 1*; SCREW3 1*; SCREW4 1*; U2 27(NC)* 29(NC)* 44(GPIO2)* 64(RESERVED)*; U4 4(PE5)* 5(PE6)* 7(PC13)* 8(PC14)* 9(PC15)* 15(PC0)* 16(PC1)* 17(PC2)* 18(PC3)* 23(PA0)* 24(PA1)* 29(PA4)* 30(PA5)* 31(PA6)* 32(PA7)* 33(PC4)* 34(PC5)* 35(PB0)* 36(PB1)* 40(PE9)* 42(PE11)* 43(PE12)* 44(PE13)* 45(PE14)* 46(PE15)* 51(PB12)* 52(PB13)* 53(PB14)* 54(PB15)* 55(PD8)* 56(PD9)* 57(PD10)* 58(PD11)* 59(PD12)* 60(PD13)* 61(PD14)* 62(PD15)* 63(PC6)* 64(PC7)* 65(PC8)* 66(PC9)* 67(PA8)* 70(PA11)* 71(PA12)* 77(PA15)* 78(PC10)* 79(PC11)* 80(PC12)* 81(PD0)* 82(PD1)* 83(PD2)* 84(PD3)* 85(PD4)* 86(PD5)* 96(PB9)* 97(PE0)* 98(PE1)*; U10 2* 7*; USB2 7(EH)* A5(CC1)* B5(CC2)*

## Notes on the sheets
sheet 1
- HC-04蓝牙模块
- 仿真/串口下载口
- type-c接口电源
- SD卡模块
- SPI数据
- GPIO/串口与噪声测试
- ESP-01s WIFI模块
- ADS1299模块
- 单片机复位按键
- 单点接入测试
- 电源测试与固件烧录
- 2x10p排插 电极接口
sheet 2
- MCU模块
- 电极输入
sheet 3
- VDD  是 +5V
  VSS  是 -5V
  DVDD 是 +3.3V
  AVDD 是 +2.5V
  AVSS 是 -2.5V
  注意！KT-0805G的原理和封装是反相的！
- ldo模块/+5转+2.5
- 螺丝
- ldo模块/+5转+3.3
- 更多扩展功能，等待V2.0更新
- ldo模块/-5转-2.5
- ldo模块/+5转-5
